# EAGLE design PIC18+Peripheral_breakout (EAGLE 7.7.0)
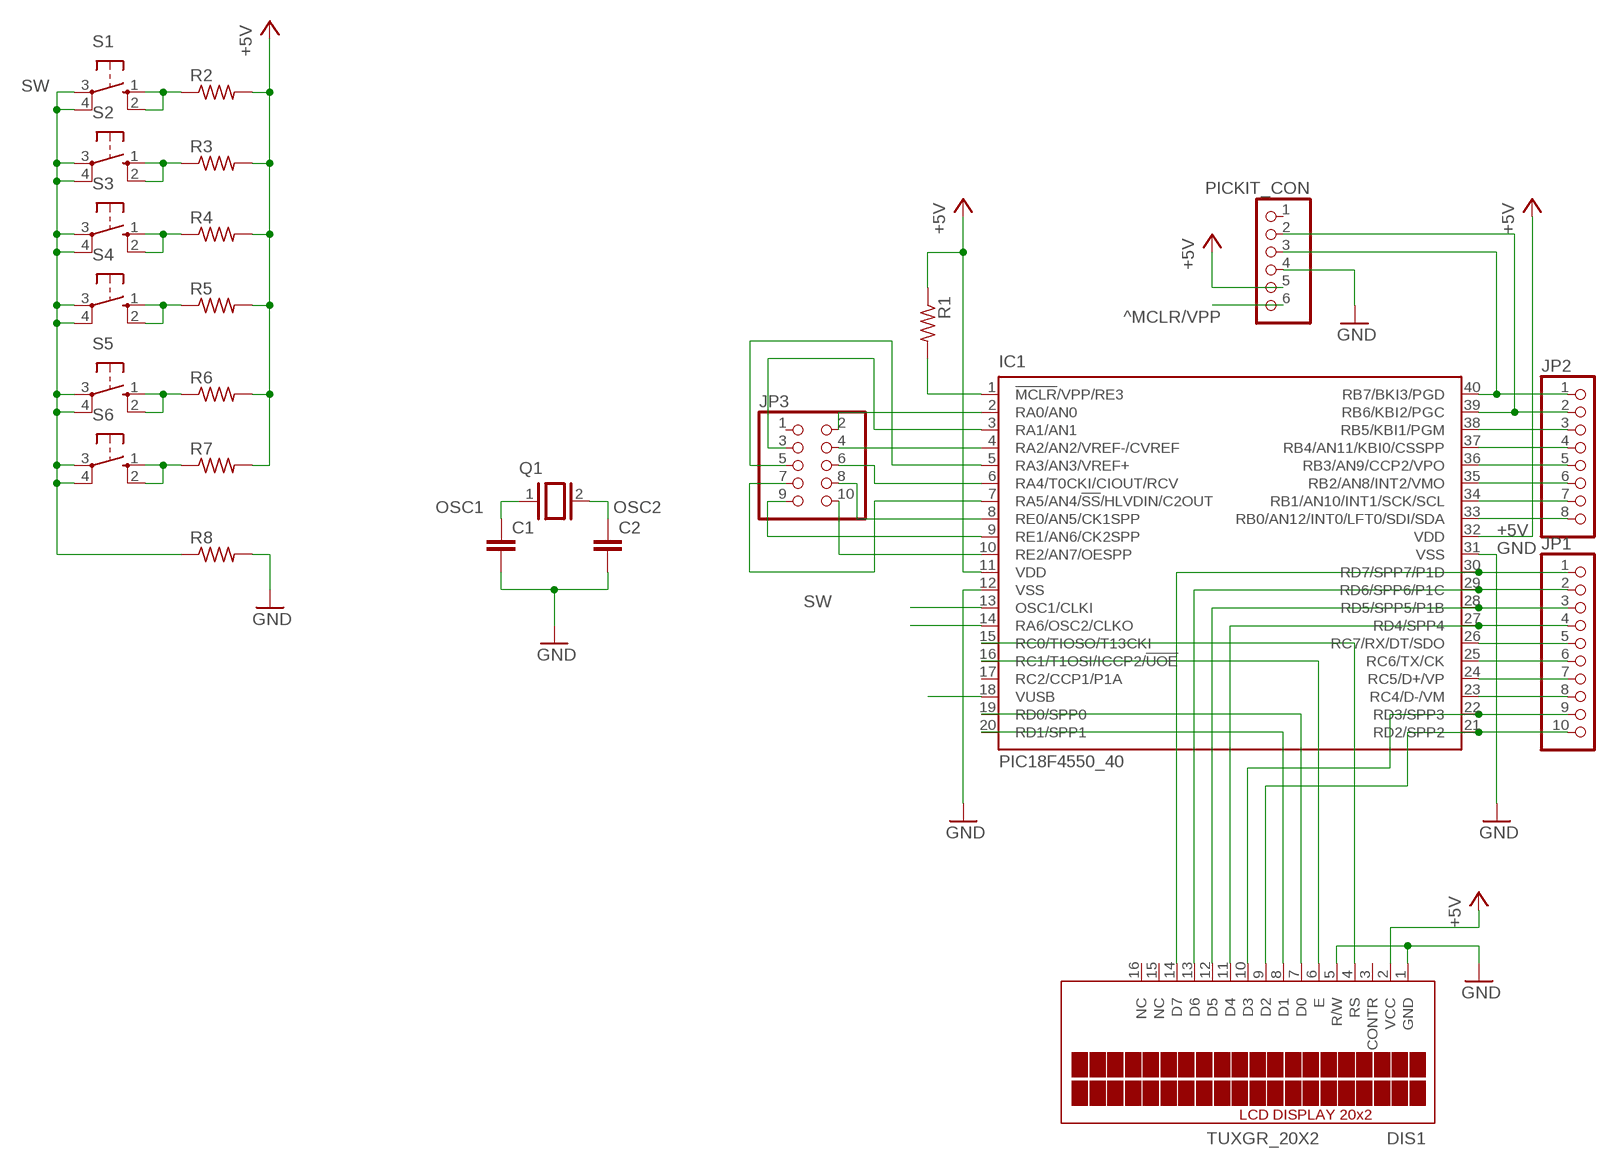
[diagram p0: schematic, sheet 1]

## Parts
C1  C-EUC1206  [C1206]
C2  C-EUC1206  [C1206]
DIS1  TUXGR_20X2  [TUXGR_20X2]
IC1  PIC18F4550_40  [DIL40]
JP1  PINHD-1X10  [1X10]
JP2  PINHD-1X8  [1X08]
JP3  PINHD-2X5  [2X05]
PICKIT_CON  PINHD-1X6/90  [1X06/90]
Q1  XTAL/S  [QS]
R1  R-US_R1206  [R1206]
R2  R-US_R1206  [R1206]
R3  R-US_R1206  [R1206]
R4  R-US_R1206  [R1206]
R5  R-US_R1206  [R1206]
R6  R-US_R1206  [R1206]
R7  R-US_R1206  [R1206]
R8  R-US_R1206  [R1206]
S1  10-XX  [B3F-10XX]
S2  10-XX  [B3F-10XX]
S3  10-XX  [B3F-10XX]
S4  10-XX  [B3F-10XX]
S5  10-XX  [B3F-10XX]
S6  10-XX  [B3F-10XX]

## Nets
+5V: DIS1.2(VCC) IC1.11(VDD) IC1.32(VDD) PICKIT_CON.5 R1.1 R2.2 R3.2 R4.2 R5.2 R6.2 R7.2
^MCLR/VPP: IC1.1(!MCLR!/VPP/RE3) PICKIT_CON.6 R1.2
D0: DIS1.7(D0) IC1.19(RD0/SPP0)
D1: DIS1.8(D1) IC1.20(RD1/SPP1)
D2: DIS1.9(D2) IC1.21(RD2/SPP2) JP1.10
D3: DIS1.10(D3) IC1.22(RD3/SPP3) JP1.9
D4: DIS1.11(D4) IC1.27(RD4/SPP4) JP1.4
D5: DIS1.12(D5) IC1.28(RD5/SPP5/P1B) JP1.3
D6: DIS1.13(D6) IC1.29(RD6/SPP6/P1C) JP1.2
D7: DIS1.14(D7) IC1.30(RD7/SPP7/P1D) JP1.1
E: DIS1.6(E) IC1.16(RC1/T1OSI/ICCP2/!UOE)
GND: C1.2 C2.2 DIS1.1(GND) DIS1.5(R/W) IC1.12(VSS) IC1.31(VSS) PICKIT_CON.4 R8.2
N$1: IC1.18(VUSB)
N$2: IC1.26(RC7/RX/DT/SDO) JP1.5
N$3: IC1.25(RC6/TX/CK) JP1.6
N$4: IC1.24(RC5/D+/VP) JP1.7
N$5: IC1.23(RC4/D-/VM) JP1.8
N$6: IC1.38(RB5/KBI1/PGM) JP2.3
N$7: IC1.37(RB4/AN11/KBI0/CSSPP) JP2.4
N$8: IC1.36(RB3/AN9/CCP2/VPO) JP2.5
N$9: IC1.35(RB2/AN8/INT2/VMO) JP2.6
N$10: IC1.34(RB1/AN10/INT1/SCK/SCL) JP2.7
N$11: IC1.33(RB0/AN12/INT0/LFT0/SDI/SDA) JP2.8
N$12: IC1.2(RA0/AN0) JP3.2
N$13: IC1.3(RA1/AN1) JP3.3
N$14: IC1.4(RA2/AN2/VREF-/CVREF) JP3.4
N$15: IC1.5(RA3/AN3/VREF+) JP3.5
N$16: IC1.6(RA4/T0CKI/CIOUT/RCV) JP3.6
N$17: IC1.8(RE0/AN5/CK1SPP) JP3.8
N$19: IC1.9(RE1/AN6/CK2SPP) JP3.9
N$20: IC1.7(RA5/AN4/!SS!/HLVDIN/C2OUT) JP3.7
N$22: R7.1 S6.1(S) S6.2(S1)
N$23: R6.1 S5.1(S) S5.2(S1)
N$24: R5.1 S4.1(S) S4.2(S1)
N$25: R4.1 S3.1(S) S3.2(S1)
N$26: R3.1 S2.1(S) S2.2(S1)
N$27: R2.1 S1.1(S) S1.2(S1)
OSC1: C1.1 IC1.13(OSC1/CLKI) Q1.1
OSC2: C2.1 IC1.14(RA6/OSC2/CLKO) Q1.2
PGC: IC1.39(RB6/KBI2/PGC) JP2.2 PICKIT_CON.2
PGD: IC1.40(RB7/BKI3/PGD) JP2.1 PICKIT_CON.3
RS: DIS1.4(RS) IC1.15(RC0/TIOSO/T13CKI)
SW: IC1.10(RE2/AN7/OESPP) JP3.10 R8.1 S1.3(P) S1.4(P1) S2.3(P) S2.4(P1) S3.3(P) S3.4(P1) S4.3(P) S4.4(P1) S5.3(P) S5.4(P1) S6.3(P) S6.4(P1)
Unconnected: DIS1.3(CONTR) DIS1.15(NC) DIS1.16(NC) IC1.17(RC2/CCP1/P1A) JP3.1 PICKIT_CON.1

## Library data of the parts
C1 C2 = resistor:C-EU: CAPACITOR, European symbol
DIS1 = display-lcd:TUXGR_20X2: Tuxgraphics LCD display 20x2 characters reflective, without background light Source: tuxgr_20x2.pdf; OC_FARNELL: unknown; OC_NEWARK: unknown
IC1 = microchip:PIC18F4*_40: USB Microcontrollers with nanoWatt Technology High-Performance, Enhanced Flash, 28/40/44-Pin, Source: http://ww1.microchip.com/downloads/en/devicedoc/39632c.pdf; MF: MICROCHIP; MPN: PIC18F4550-I/P; OC_FARNELL: 9321357; OC_NEWARK: 74K8623
JP1 = pinhead:PINHD-1X10: PIN HEADER
JP2 = pinhead:PINHD-1X8: PIN HEADER
JP3 = pinhead:PINHD-2X5: PIN HEADER
PICKIT_CON = pinhead:PINHD-1X6: PIN HEADER
Q1 = special:XTAL/S: CRYSTAL
R1-R8 = rcl:R-US_: RESISTOR, American symbol
S1-S6 = switch-omron:10-XX: OMRON SWITCH; MPN: B3F-1000; OC_FARNELL: 176432; OC_NEWARK: 36M3542

## Board
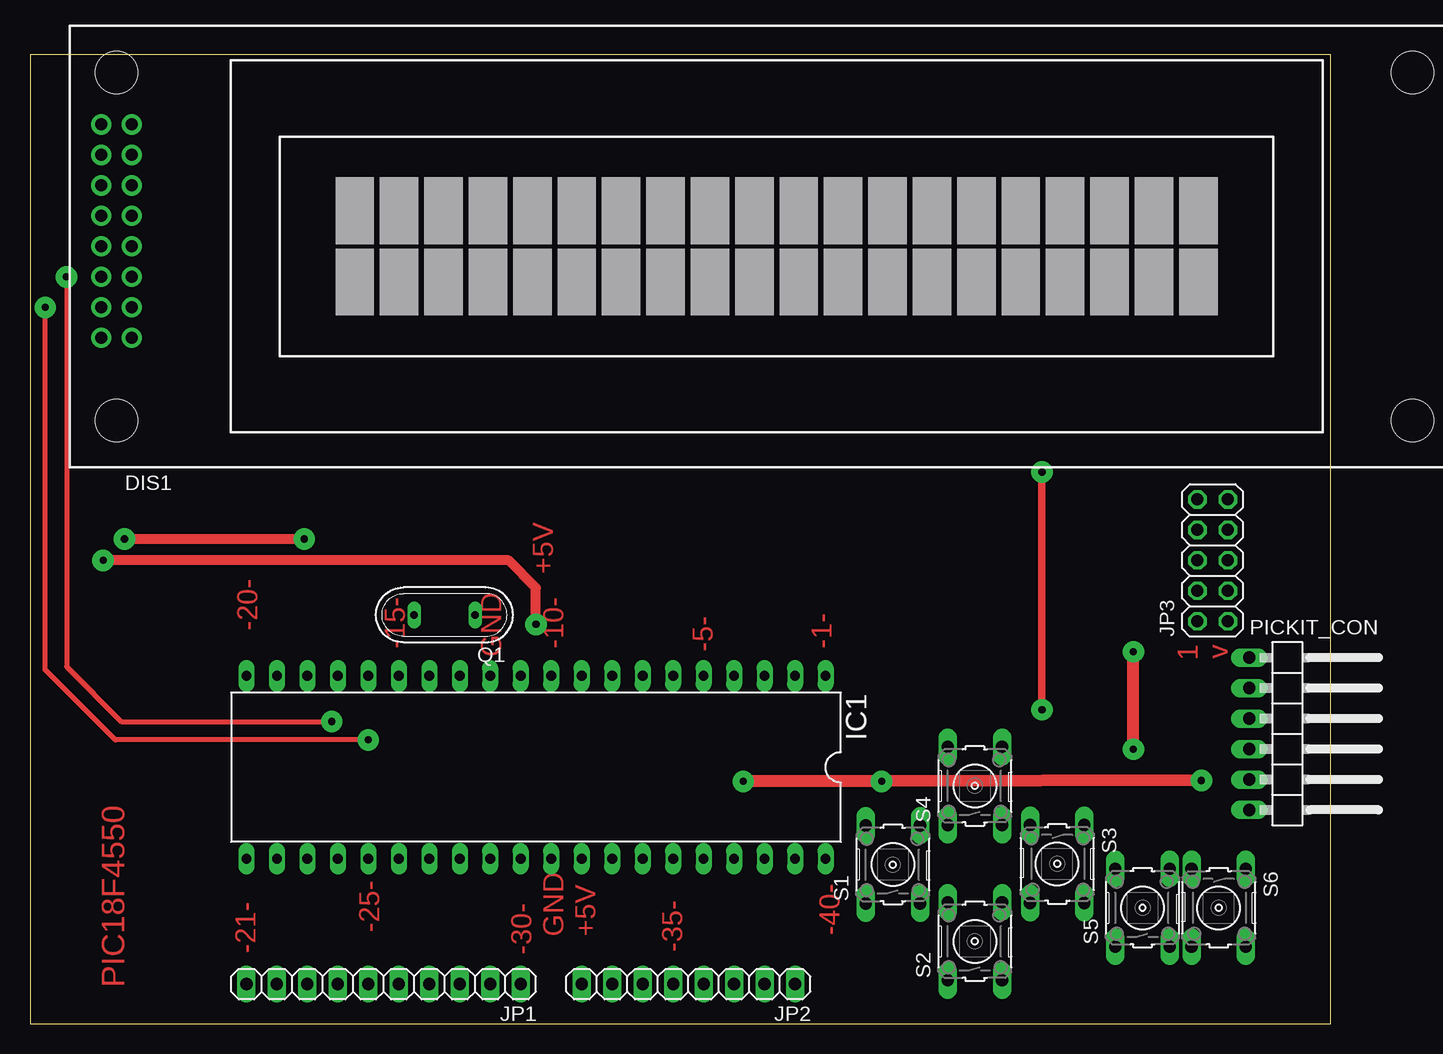
[diagram p1: board, top side]
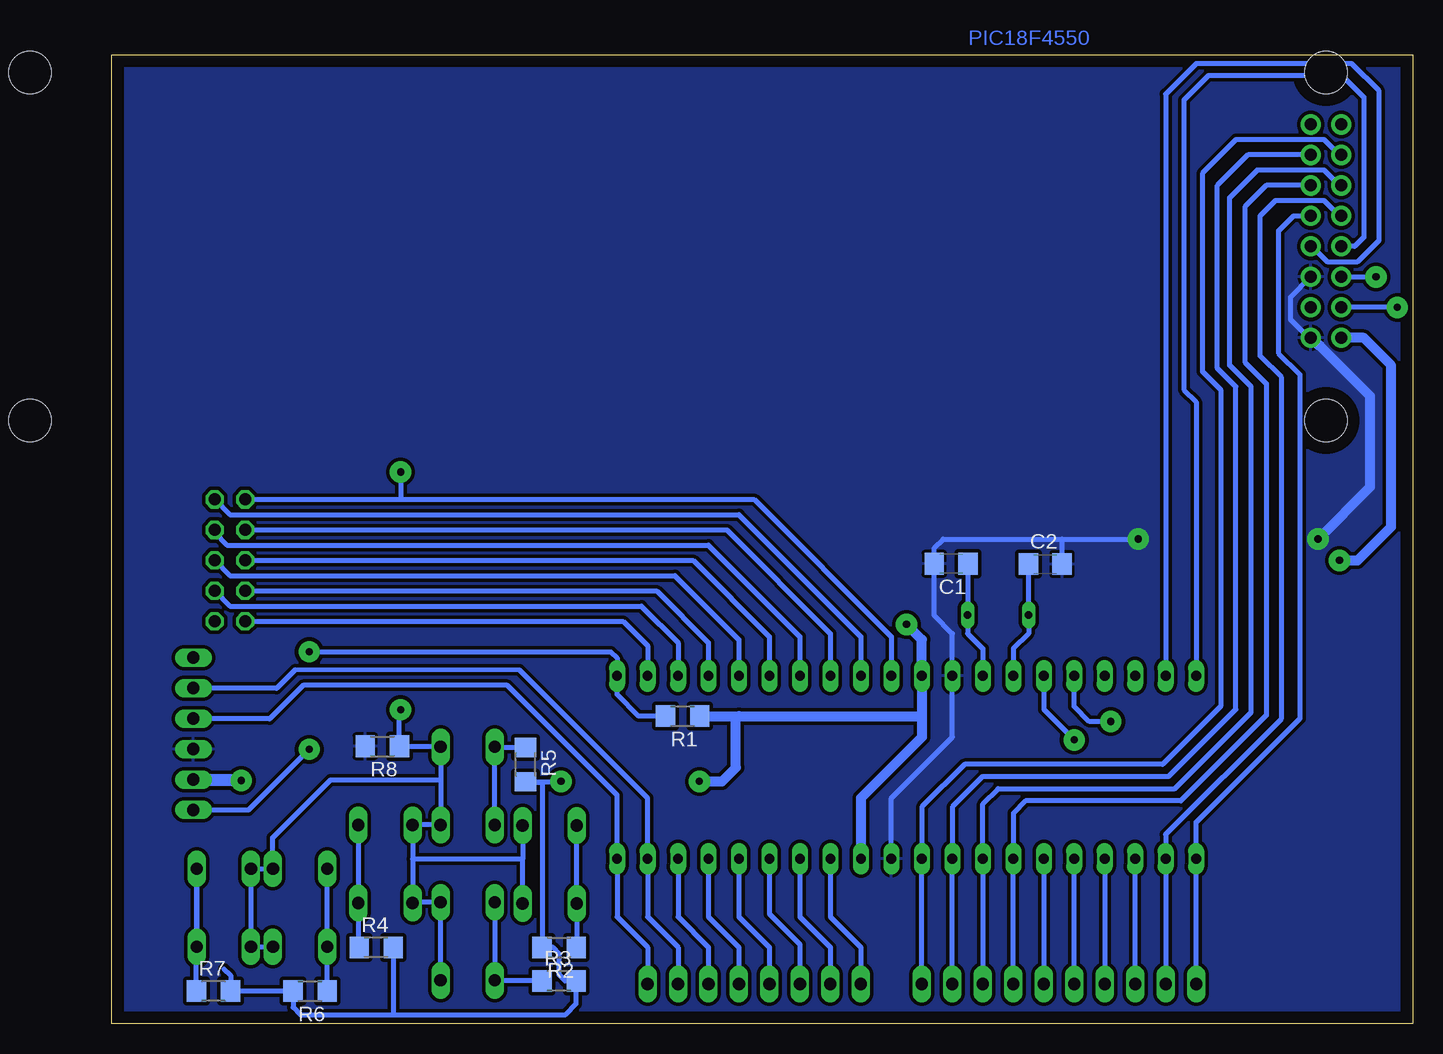
[diagram p2: board, bottom side, seen from below]

Size 108.38 x 80.76 mm. Coordinates in mm from the lower left corner, seen from the top.
Outline: 0,0 108.38,0 108.38,80.76 0,80.76 0,0
Copper layers (1*16): Top 0.035mm / dielectric 1.5mm / Bottom 0.035mm
Design rules "default": minimum track width 10mil, minimum drill 24mil, track to track 8mil, track to pad 8mil, pad to pad 8mil, via to via 8mil, smd to smd 8mil, copper to edge 40mil, drill to drill 8mil, minimum pad ring 10mil, minimum via ring 8mil, stop-mask expansion 4mil, vias tented up to drill 0mil, thermal gap 10mil

### Footprints (pad centres in the part's own frame; a part is rotated, then mirrored left to right if it is on the bottom)
C1206 = smd 1.6 x 1.8: 1 -1.4,0; 2 1.4,0
TUXGR_20X2 = drill 1 pad 1.676: 1 -52.73,-7.62; 2 -55.27,-7.62; 3 -52.73,-5.08; 4 -55.27,-5.08; 5 -52.73,-2.54; 6 -55.27,-2.54; 7 -52.73,0; 8 -55.27,0; 9 -52.73,2.54; 10 -55.27,2.54; 11 -52.73,5.08; 12 -55.27,5.08; 13 -52.73,7.62; 14 -55.27,7.62; 15 -52.73,10.16; 16 -55.27,10.16 | hole 3.5: -54,-14.5; 54,-14.5; -54,14.5; 54,14.5
DIL40 = drill 0.813 long: 1 -24.13,-7.62; 2 -21.59,-7.62; 3 -19.05,-7.62; 4 -16.51,-7.62; 5 -13.97,-7.62; 6 -11.43,-7.62; 7 -8.89,-7.62; 8 -6.35,-7.62; 9 -3.81,-7.62; 10 -1.27,-7.62; 11 1.27,-7.62; 12 3.81,-7.62; 13 6.35,-7.62; 14 8.89,-7.62; 15 11.43,-7.62; 16 13.97,-7.62; 17 16.51,-7.62; 18 19.05,-7.62; 19 21.59,-7.62; 20 24.13,-7.62; 21 24.13,7.62; 22 21.59,7.62; 23 19.05,7.62; 24 16.51,7.62; 25 13.97,7.62; 26 11.43,7.62; 27 8.89,7.62; 28 6.35,7.62; 29 3.81,7.62; 30 1.27,7.62; 31 -1.27,7.62; 32 -3.81,7.62; 33 -6.35,7.62; 34 -8.89,7.62; 35 -11.43,7.62; 36 -13.97,7.62; 37 -16.51,7.62; 38 -19.05,7.62; 39 -21.59,7.62; 40 -24.13,7.62
1X10 = drill 1.016 long: 1 -11.43,0; 2 -8.89,0; 3 -6.35,0; 4 -3.81,0; 5 -1.27,0; 6 1.27,0; 7 3.81,0; 8 6.35,0; 9 8.89,0; 10 11.43,0
1X08 = drill 1.016 long: 1 -8.89,0; 2 -6.35,0; 3 -3.81,0; 4 -1.27,0; 5 1.27,0; 6 3.81,0; 7 6.35,0; 8 8.89,0
2X05 = drill 1.016 octagon: 1 -5.08,-1.27; 2 -5.08,1.27; 3 -2.54,-1.27; 4 -2.54,1.27; 5 0,-1.27; 6 0,1.27; 7 2.54,-1.27; 8 2.54,1.27; 9 5.08,-1.27; 10 5.08,1.27
1X06/90 = drill 1.016 long: 1 -6.35,-3.81; 2 -3.81,-3.81; 3 -1.27,-3.81; 4 1.27,-3.81; 5 3.81,-3.81; 6 6.35,-3.81
QS = drill 0.61 long: 1 -2.54,0; 2 2.54,0
R1206 = smd 1.6 x 1.803: 1 -1.422,0; 2 1.422,0
B3F-10XX = drill 1.016 long: 1 -3.251,2.261; 2 3.251,2.261; 3 -3.251,-2.261; 4 3.251,-2.261

### Placement (x,y rotation side)
C1  38.46,38.33 180 bottom
C2  30.61,38.3 0 bottom
DIS1  61.21,64.77 0 top
IC1  42.16,21.36 180 top
JP1  29.46,3.3 180 top
JP2  54.86,3.3 180 top
JP3  98.55,38.61 90 top
PICKIT_CON  105.41,24.16 270 top
Q1  34.54,34.06 180 top
R1  60.83,25.63 180 bottom
R2  71.12,6.35 180 bottom
R3  71.12,3.56 0 bottom
R4  86.36,6.35 0 bottom
R5  73.91,21.59 270 bottom
R6  91.87,2.72 180 bottom
R7  99.92,2.72 0 bottom
R8  85.85,23.11 180 bottom
S1  71.91,13.26 90 top
S2  78.74,6.86 90 top
S3  85.6,13.31 270 top
S4  78.74,19.81 90 top
S5  92.71,9.65 90 top
S6  99.06,9.65 270 top

### Tracks (layer width: path | path; a pad name or v marks a point on that pad's centre or on a via)
+5V  (via drill 0.6 pad 1.78)
  Top 0.813: v42.16,33.27 42.16,36.32 39.88,38.61 v6.1,38.61
  Top 1.016: v59.44,20.19 v70.97,20.19 v97.61,20.27
  Bottom 0.406: 40.92,25.63 40.89,25.65 | PICKIT_CON.5 101.58,20.32 | 99.06,4.57 98.5,4.01 R7.2 R6.2 93.29,1.35 92.71,0.76 84.84,0.76 | R3.2 70.61,3.56 71.12,4.06 71.12,5.84 71.63,6.35 R2.2 72.52,6.38 72.52,20.09 73.84,20.09 R5.2 70.99,20.17 v70.97,20.19 | 84.84,0.76 70.59,0.76 69.7,1.65 R3.2 | R3.2 | R4.2 84.94,0.86 84.84,0.76 | 59.44,25.6 R1.1
  Bottom 0.813: IC1.32 45.97,18.8 40.89,23.88 40.89,25.65 IC1.11 40.89,32 v42.16,33.27 | v6.1,38.61 4.57,38.61 1.78,41.4 1.78,54.86 4.06,57.15 DIS1.2 | R1.1 56.13,25.63 | 56.13,25.63 40.92,25.63 | v59.44,20.19 57.53,20.19 56.39,21.34 56.39,25.38 56.13,25.63
  Bottom 1.016: v97.61,20.27 101.52,20.27 PICKIT_CON.5
^MCLR/VPP  (via drill 0.6 pad 1.78)
  Top 1.016: v91.95,22.86 v91.95,30.99
  Bottom 0.406: R1.2 64.49,25.63 66.29,27.43 66.29,28.45 IC1.1 66.29,30.48 66.8,30.99 v91.95,30.99 | PICKIT_CON.6 97,17.8 v91.95,22.86
D0
  Bottom 0.406: DIS1.7 8.38,64.77 7.11,63.5 4.57,63.5 2.79,65.28 2.79,77.72 5.08,80.01 18.03,80.01 20.57,77.47 IC1.19
D1
  Bottom 0.406: DIS1.8 4.83,64.77 4.06,65.53 4.06,77.22 5.84,78.99 17.02,78.99 19.05,76.96 19.05,52.83 18.03,51.82 IC1.20
D2
  Bottom 0.406: DIS1.9 9.91,67.31 11.18,66.04 11.18,55.88 9.4,54.1 9.4,25.43 18.03,16.79 IC1.21 JP1.10
D3
  Bottom 0.406: DIS1.10 6.1,67.31 7.37,68.58 11.43,68.58 12.7,67.31 12.7,55.63 10.92,53.85 10.92,25.43 20.57,15.77 IC1.22 JP1.9
D4
  Bottom 0.406: DIS1.11 12.19,69.85 13.97,68.07 13.97,55.12 12.19,53.34 12.19,25.68 19.3,18.57 32.26,18.57 33.27,17.55 IC1.27 JP1.4
D5
  Bottom 0.406: DIS1.12 6.1,69.85 7.37,71.12 12.95,71.12 15.24,68.83 15.24,54.86 13.46,53.09 13.46,25.93 19.81,19.58 34.54,19.58 35.81,18.31 IC1.28 JP1.3
D6
  Bottom 0.406: DIS1.13 13.72,72.39 16.26,69.85 16.26,54.61 14.73,53.09 14.73,26.19 20.32,20.6 35.81,20.6 38.35,18.06 IC1.29 JP1.2
D7
  Bottom 0.406: DIS1.14 6.1,72.39 7.37,73.66 14.73,73.66 17.53,70.87 17.53,54.36 16,52.83 16,26.44 20.83,21.61 37.34,21.61 40.89,18.06 IC1.30 JP1.1
E  (via drill 0.6 pad 1.78)
  Top 0.406: v3.05,62.23 3.05,29.74 7.62,25.17 v25.15,25.17
  Bottom 0.406: DIS1.6 v3.05,62.23 | v25.15,25.17 26.92,25.17 28.19,26.44 IC1.16
GND  (via drill 0.6 pad 1.78)
  Top 0.813: v22.86,40.39 v7.87,40.39
  Bottom 0.406: IC1.31 43.43,18.8 38.35,23.88 IC1.12 38.35,32.51 39.88,34.04 39.88,38.31 C1.2 39.86,39.65 39.12,40.39 29.21,40.39 | 29.21,40.39 v22.86,40.39 | 7.87,56.54 DIS1.1 8.64,57.15 10.16,58.67 10.16,60.55 DIS1.5 | C2.2 29.21,40.38 29.21,40.39
  Bottom 0.813: 7.87,56.54 7.77,56.54 3.56,52.32 3.56,44.7 v7.87,40.39
  pour Bottom (isolate 0.305): 0,80.77 0,0 108.2,0 108.2,80.77
N$2
  Bottom 0.406: IC1.26 JP1.5
N$3
  Bottom 0.406: JP1.6 IC1.25
N$4
  Bottom 0.406: IC1.24 JP1.7
N$5
  Bottom 0.406: JP1.8 IC1.23
N$6
  Bottom 0.406: IC1.38 61.21,8.89 58.67,6.35 JP2.3
N$7
  Bottom 0.406: IC1.37 58.67,8.89 56.13,6.35 JP2.4
N$8
  Bottom 0.406: IC1.36 56.13,8.89 53.59,6.35 JP2.5
N$9
  Bottom 0.406: IC1.35 53.59,9.14 51.05,6.6 JP2.6
N$10
  Bottom 0.406: IC1.34 51.05,8.89 48.51,6.35 JP2.7
N$11
  Bottom 0.406: IC1.33 48.51,8.89 45.97,6.35 JP2.8
N$12
  Bottom 0.406: JP3.2 65.79,33.53 63.75,31.5 IC1.2
N$13
  Bottom 0.406: JP3.3 98.55,34.8 64.26,34.8 61.21,31.75 IC1.3
N$14
  Bottom 0.406: JP3.4 62.99,36.07 58.67,31.75 IC1.4
N$15
  Bottom 0.406: JP3.5 98.55,37.34 61.47,37.34 56.13,32 IC1.5
N$16
  Bottom 0.406: JP3.6 59.94,38.61 53.59,32.26 IC1.6
N$17
  Bottom 0.406: JP3.8 57.15,41.15 48.51,32.51 IC1.8
N$19
  Bottom 0.406: JP3.9 98.55,42.42 56.13,42.42 45.97,32.26 IC1.9
N$20
  Bottom 0.406: JP3.7 99.82,40.89 98.81,39.88 58.67,39.88 51.05,32.26 IC1.7
N$22
  Bottom 0.406: S6.2 S6.1 101.32,9.35 R7.1
N$23
  Bottom 0.406: S5.1 S5.2 90.45,9.35 R6.1
N$24
  Bottom 0.406: S4.1 S4.2 76.43,23.01 R5.1
N$25
  Bottom 0.406: S3.1 S3.2 87.86,6.43 R4.1
N$26
  Bottom 0.406: S2.2 S2.1 76.94,3.56 R3.1
N$27
  Bottom 0.406: S1.2 S1.1 69.65,6.4 R2.1
OSC1
  Bottom 0.406: IC1.13 35.81,31.24 37.08,32.51 Q1.1 37.06,34.09 C1.1
OSC2
  Bottom 0.406: IC1.14 33.27,31.24 32,32.51 Q1.2 C2.1
PGC
  Bottom 0.406: JP2.2 61.21,6.35 63.75,8.89 IC1.39 63.75,18.8 74.42,29.46 93.12,29.49 94.67,27.94 101.58,27.94 PICKIT_CON.2
PGD
  Bottom 0.406: JP2.1 63.75,6.35 66.29,8.89 IC1.40 66.29,19.05 75.44,28.19 92.46,28.19 95.25,25.4 101.58,25.4 PICKIT_CON.3
RS  (via drill 0.6 pad 1.78)
  Top 0.406: v28.19,23.65 7.11,23.65 1.27,29.49 v1.27,59.69
  Bottom 0.406: IC1.15 30.73,26.19 v28.19,23.65 | v1.27,59.69 DIS1.4
SW  (via drill 0.6 pad 1.78)
  Top 0.61: v84.33,26.16 v84.33,45.97
  Bottom 0.406: JP3.10 84.33,43.69 | 84.33,43.69 54.86,43.69 43.43,32.26 IC1.10 | 81,20.32 S4.4 81.05,23.11 R8.1 84.43,25.55 v84.33,26.16 | 81,20.32 S4.3 S3.3 83.34,13.72 | 83.34,13.72 S3.4 83.29,10.11 S2.4 S2.3 | S1.3 74.17,13.72 | S1.4 74.17,13.72 | 74.17,13.72 83.34,13.72 | S5.3 S6.4 S6.3 S5.4 94.97,15.47 95,15.49 90.17,20.32 81,20.32 | v84.33,45.97 84.33,43.69

### Text on the board
Top: +5V | -20- | GND | 1 / v | -15- | -10- | -5- | -1- | -25- | -40- | GND | +5V | -21- | -30- | -35- | PIC18F4550
Bottom: PIC18F4550